# Altium schematic sheet PWJACK+SWITCH.SchDoc: Power Jack & Switch
size A4; Organization: Altium Limited.; Address1: Level 3, 12a Rodborough Rd; Address2: Frenchs Forest 2086; Address3: NSW; Address4: AUSTRALIA; DocumentNumber: 62; Revision: 6; SheetNumber: 62; SheetTotal: 64
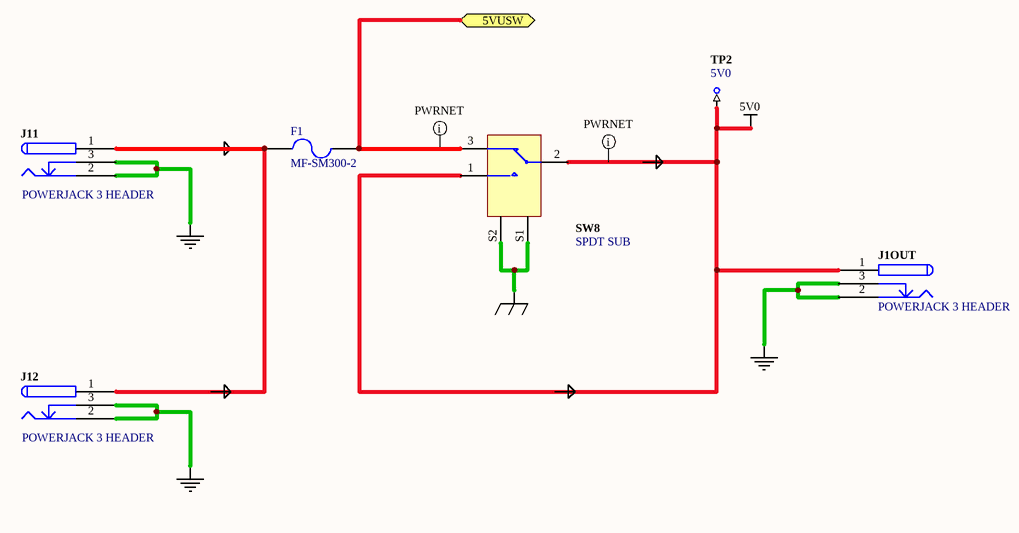
[diagram p0: PWJACK+SWITCH.SchDoc]

## Parts
F1  MF-SM300-2  [MF_SM250]
J1OUT  POWERJACK 3 HEADER  [KLD-0202]
J11  POWERJACK 3 HEADER  [KLD-0202]
J12  POWERJACK 3 HEADER  [KLD-0202]
SW8  SPDT SUB  [T8019L-TNQ]
TP2  5V0  [TestPin]  (no BOM)

## Ports
5VUSW

## Nets
5V0: J1OUT.1 SW8.1 SW8.2 TP2.1
GND: J1OUT.2 J1OUT.3 J11.2 J11.3 J12.2 J12.3
SHIELD: SW8.S1 SW8.S2
5VUSW: F1.2 SW8.3 ; port 5VUSW
NetF1_1: F1.1 J11.1 J12.1

## Layout directives
net class PWRNET: 5V0, 5VUSW

## Notes on the sheet
- Sheet Title
- Project Title
- Size:
- Date:
- A4
- Assy:
- Time:
- Sheet
- Revision:
- of
- File:

## Library data of the parts
F1 = D-106-0002: Mutifuse, SMD 8A; Amperage: 5 A; Rated Voltage: mV; Category: Fuse
J1OUT J11 J12 = D-300-0007: Connector, 3 Conductor Power Jack 2 break 2 aux contacts; ClassName: COMP_5V0; Category: Connector; Connector type: POWERJACK 3 HEADER; Status: Production
SW8 = D-301-0000: Switch, SPDT Subminiature Toggle; ClassName: COMP_5V0; Category: Switch; Status: Production
TP2 = D-006-0000: Test Point, PCB Mount with Silkscreen Box; Category: Test-Point; Status: Production